# EAGLE design Nusbio.smd (EAGLE 7.5.0)
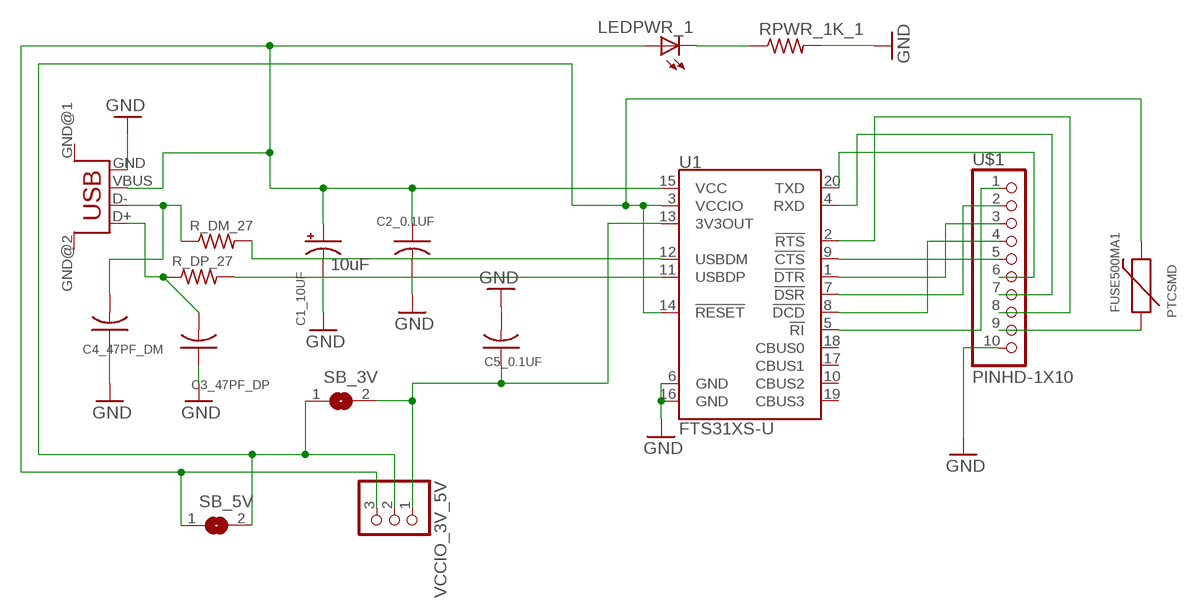
[diagram p0: schematic, sheet 1]

## Parts
C1_10UF  10uF  10UF-16V-10%(TANT)  [EIA3216]
C2_0.1UF  C-USC1206  [C1206]
C3_47PF_DP  C-USC1206  [C1206]
C4_47PF_DM  C-USC1206  [C1206]
C5_0.1UF  C-USC1206  [C1206]
FUSE500MA1  PTCSMD  [PTC-1206]
LEDPWR_1  LEDCHIPLED_0805  [CHIPLED_0805]
R_DM_27  R-US_R0805  [R0805]
R_DP_27  R-US_R0805  [R0805]
RPWR_1K_1  R-US_R0805  [R0805]
SB_3V  SOLDERJUMPERREFLOW  [SOLDERJUMPER_REFLOW]
SB_5V  SOLDERJUMPERREFLOW  [SOLDERJUMPER_REFLOW]
U1  FTS31XS-U  FT231XS  [SSOP20_L]
U$1  PINHD-1X10  [1X10-BIG]
USB_FEMALE  USB  [USB-FEMALE-A-PTH]
VCCIO_3V_5V  PINHD-1X3  [1X03]

## Nets
GND: C1_10UF.C(-) C2_0.1UF.2 C3_47PF_DP.1 C4_47PF_DM.1 C5_0.1UF.2 RPWR_1K_1.2 U1.6(GND) U1.16(GND) U$1.10 USB_FEMALE.GND
N$1: FUSE500MA1.1 U$1.9
N$2: C5_0.1UF.1 SB_3V.2 U1.13(3V3OUT) VCCIO_3V_5V.1
N$3: LEDPWR_1.C RPWR_1K_1.1
N$4: R_DM_27.2 U1.12(USBDM)
N$5: R_DP_27.2 U1.11(USBDP)
N$6: U1.20(TXD) U$1.6
N$7: U1.7(!DSR) U$1.2
N$8: U1.5(!RI) U$1.1
N$9: U1.1(!DTR) U$1.3
N$10: U1.8(!DCD) U$1.4
N$11: U1.9(!CTS) U$1.5
N$12: U1.4(RXD) U$1.7
N$13: U1.2(!RTS) U$1.8
N$14: FUSE500MA1.2 SB_3V.1 SB_5V.2 U1.3(VCCIO) U1.14(!RESET) VCCIO_3V_5V.2
N$15: C3_47PF_DP.2 R_DP_27.1 USB_FEMALE.D+
N$16: C4_47PF_DM.2 R_DM_27.1 USB_FEMALE.D-
N$17: C1_10UF.A(+) C2_0.1UF.1 LEDPWR_1.A SB_5V.1 U1.15(VCC) USB_FEMALE.VBUS VCCIO_3V_5V.3
Unconnected: U1.10(CBUS2) U1.17(CBUS1) U1.18(CBUS0) U1.19(CBUS3) USB_FEMALE.GND@1(GND) USB_FEMALE.GND@2(GND)

## Library data of the parts
C1_10UF = SparkFun-Capacitors:10UF-16V-10%(TANT): CAP-00811 1206/EIA-3216 Tantalum capacitor; PROD_ID: CAP-00811
C2_0.1UF C3_47PF_DP C4_47PF_DM C5_0.1UF = adafruit:C-US: CAPACITOR, American symbol
FUSE500MA1 = SparkFun-PowerIC:PTC: Resettable Fuse PTC Resettable Fuse. Spark Fun Electronics SKU : COM-08357; PROD_ID: RES-11150
LEDPWR_1 = adafruit:LED: LED OSRAM: - CHIPLED LG R971, LG N971, LY N971, LG Q971, LY Q971, LO R971, LY R971 LH N974, LH R974 LS Q976, LO Q976, LY Q976 LO Q996 - Hyper CHIPLED LW Q18S LB Q993, LB Q99A, LB R99A - SideLED LS A670, LO A670, LY A670, LG A670, LP A670 LB A673, LV A673, LT A673, LW A673 LH A674 LY A675 LS A676, LA A676, LO A676, LY A676, LW A676 LS A679, LY A679, LG A679 - Hyper Micro SIDELED® LS Y876, LA Y876, LO Y876, LY Y876 LT Y87S - SmartLED LW L88C, LW L88S LB L89C, LB L89S, LG L890 LS L89K, LO L89K, LY L89K LS L896, LA L896, LO L896, LY L896 - TOPLED LS T670, LO T670, LY T670, LG T670, LP T670 LSG T670, LSP T670, LSY T670, LOP T670, LYG T670 LG T671, LOG T671, LSG T671 LB T673, LV T673, LT T673, LW T673 LH T674 LS T676, LA T676, LO T676, LY T676, LB T676, LH T676, LSB T676, LW T676 LB T67C, LV T67C, LT T67C, LS T67K, LO T67K, LY T67K, LW E67C LS E67B, LA E67B, LO E67B, LY E67B, LB E67C, LV E67C, LT E67C LW T67C LS T679, LY T679, LG T679 LS T770, LO T770, LY T770, LG T770, LP T770 LB T773, LV T773, LT T773, LW T773 LH T774 LS E675, LA E675, LY E675, LS T675 LS T776, LA T776, LO T776, LY T776, LB T776 LHGB T686 LT T68C, LB T68C - Hyper Mini TOPLED® LB M676 - Mini TOPLED Santana® LG M470 LS M47K, LO M47K, LY M47K Source: http://www.osram.convergy.de/
R_DM_27 R_DP_27 RPWR_1K_1 = adafruit:R-US_: RESISTOR, American symbol
SB_3V SB_5V = microbuilder:SOLDERJUMPER: SMD Solder JUMPER Solder the two pads together to create a connection, or remove the solder to break it. REFLOW - Use this footprint for solder paste and reflow ovens. WAVE - Use this footprint for hand-soldering (larger pads). CLOSED - Has a trace between the two pads to ensure it is closed by default. The trace needs to be cut to disable the jumper, and can be closed again by creating a solder bridge between the two pads.
U1 = SparkFun-DigitalIC:FT231X: FTDI FT231X Full Speed USB to Full-handshake UART This USB2.0 Full Speed IC offers a compact bridge to full handshake UART interfaces. The device is a UART, capable of operating up to 3MBaud, with low power consumption (8mA). The FT231X includes the complete FT-X series feature set and enables USB to be added into a system design quickly and easily over a UART interface.; PROD_ID: IC-11524
U$1 = adafruit:PINHD-1X10: Pin header 1x10 0.1" spacing With round pins
USB_FEMALE = STUNTAZ:USB: USB Connectors USB-FEMALE-A-PTH: Through hole Female Type A Connector
VCCIO_3V_5V = adafruit:PINHD-1X3: PIN HEADER

## Board
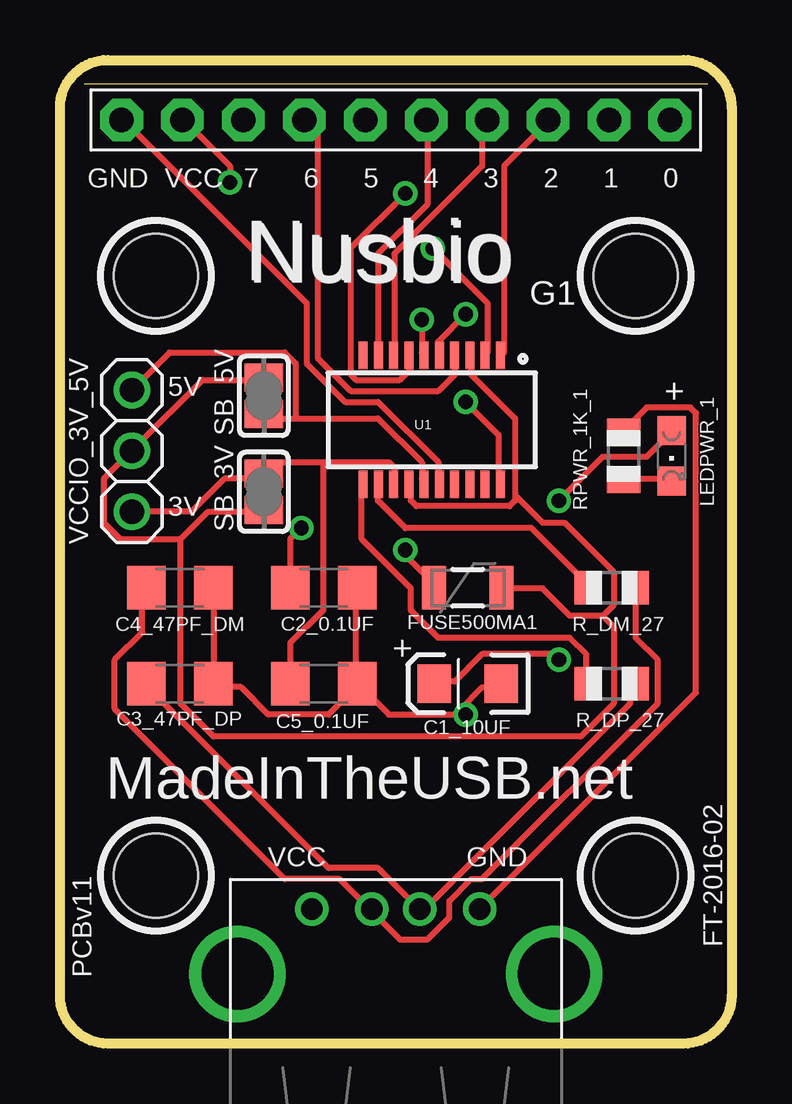
[diagram p1: board, top side]
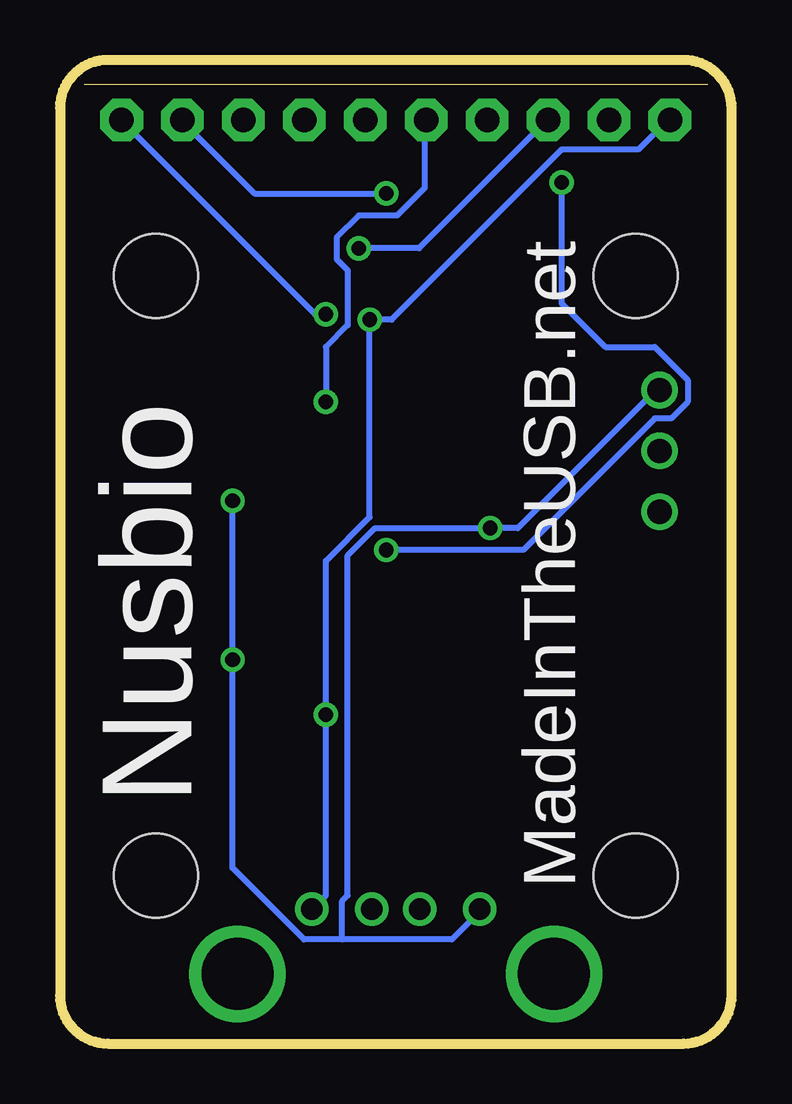
[diagram p2: board, bottom side, seen from below]

Size 28 x 41 mm. Coordinates in mm from the lower left corner, seen from the top.
Outline: 27,40 1,40
Outline: 2,0 arc-90 0,2 0,39 arc-90 2,41 26,41 arc-90 28,39 28,2 arc-90 26,0 2,0
Copper layers (1*16): Top 0.035mm / dielectric 1.5mm / Bottom 0.035mm
Design rules "default": minimum track width 10mil, minimum drill 24mil, track to track 8mil, track to pad 8mil, pad to pad 8mil, via to via 8mil, smd to smd 8mil, copper to edge 40mil, drill to drill 8mil, minimum pad ring 10mil, minimum via ring 8mil, stop-mask expansion 4mil, vias tented up to drill 0mil, thermal gap 10mil
Holes 3.5 mm at 4,7 24,7 24,32 4,32

### Footprints (pad centres in the part's own frame; a part is rotated, then mirrored left to right if it is on the bottom)
EIA3216 = smd 1.4 x 1.6: A 1.4,0; C -1.4,0
C1206 = smd 1.6 x 1.8: 1 -1.4,0; 2 1.4,0
PTC-1206 = smd 1 x 1.8: 1 -1.4,0; 2 1.4,0
CHIPLED_0805 = smd 1.2 x 1.2: A 0,-1.05; C 0,1.05
R0805 = smd 1.1 x 1.4: 1 -1,0; 2 1,0
SOLDERJUMPER_REFLOW = smd 1.168 x 1.6: 1 -0.762,0; 2 0.762,0
SSOP20_L = smd 0.381 x 1.143: 1 -2.857,-2.68; 2 -2.223,-2.68; 3 -1.587,-2.68; 4 -0.953,-2.68; 5 -0.318,-2.68; 6 0.318,-2.68; 7 0.953,-2.68; 8 1.587,-2.68; 9 2.223,-2.68; 10 2.857,-2.68; 11 2.857,2.68; 12 2.223,2.68; 13 1.587,2.68; 14 0.953,2.68; 15 0.318,2.68; 16 -0.318,2.68; 17 -0.953,2.68; 18 -1.587,2.68; 19 -2.223,2.68; 20 -2.857,2.68
1X10-BIG = drill 1.016 pad 1.778 octagon: 1 -11.43,0; 2 -8.89,0; 3 -6.35,0; 4 -3.81,0; 5 -1.27,0; 6 1.27,0; 7 3.81,0; 8 6.35,0; 9 8.89,0; 10 11.43,0
USB-FEMALE-A-PTH = drill 0.9: D+ 5.9,1.3; D- 7.9,1.3; GND 3.4,1.3; VBUS 10.4,1.3 | drill 3: GND@1 13.5,4; GND@2 0.3,4
1X03 = drill 1.016: 1 -2.54,0; 2 0,0; 3 2.54,0

### Placement (x,y rotation side)
C1_10UF  17,15 180 top
C2_0.1UF  11,19 0 top
C3_47PF_DP  5,15 180 top
C4_47PF_DM  5,19 180 top
C5_0.1UF  11,15 0 top
FUSE500MA1  17,19 0 top
LEDPWR_1  25.5,24.5 180 top
R_DM_27  23,19 180 top
R_DP_27  23,15 180 top
RPWR_1K_1  23.5,24.5 90 top
SB_3V  8.5,23 90 top
SB_5V  8.5,27 90 top
U1  15.5,26 180 top
U$1  14,38.5 180 top
USB_FEMALE  20.9,6.9 180 top
VCCIO_3V_5V  3,24.7 90 top

### Tracks (layer width: path | path; a pad name or v marks a point on that pad's centre or on a via)
GND  (via drill 0.61)
  Top 0.254: U1.16 15.77,23.55 15.77,24.23 13.26,26.75 11.89,26.75 10.29,28.35 10.29,30.86 2.74,38.41 U$1.10 | v15.09,30.18 15.09,28.8 U1.6 | C4_47PF_DM.1 6.4,18.97 6.4,15.09 C3_47PF_DP.1 6.4,14.86 7.54,14.86 8.69,13.72 11.2,13.72 12.34,14.86 C5_0.1UF.2 | 16.69,13.95 16.46,13.72 13.72,13.72 12.57,14.86 C5_0.1UF.2 | 16.69,13.95 17.6,14.86 18.29,14.86 C1_10UF.C | C2_0.1UF.2 12.34,18.97 12.34,15.09 C5_0.1UF.2 | RPWR_1K_1.2 23.55,25.6 24.46,26.52 26.29,26.52 26.52,26.29 26.52,14.63 17.6,5.71 USB_FEMALE.GND | v16.92,13.72 16.69,13.95
  Bottom 0.254: U$1.10 2.74,38.41 3.89,37.26 7.09,37.26 14.17,30.18 v15.09,30.18 15.09,21.95 16.92,20.12 v16.92,13.72 16.92,6.17 17.37,5.71 USB_FEMALE.GND
N$1  (via drill 0.61)
  Top 0.254: v14.4,20.57 14.4,20.34 15.54,19.2 FUSE500MA1.1 | v7.09,35.89 7.09,36.58 5.26,38.41 U$1.9
  Bottom 0.254: v14.4,20.57 8.69,20.57 3.2,26.06 2.52,26.06 1.83,26.75 1.83,27.66 3.2,29.03 5.26,29.03 7.09,30.86 v7.09,35.89
N$2
  Top 0.254: 10.97,24.23 9.14,24.23 8.69,23.77 SB_3V.2 8.46,23.55 6.86,23.55 5.49,22.17 3.2,22.17 VCCIO_3V_5V.1 | 10.97,24.23 13.72,24.23 13.95,24 13.95,23.55 U1.13 | 10.97,24.23 10.97,18.06 9.6,16.69 9.6,15.09 C5_0.1UF.1
N$3
  Top 0.254: LEDPWR_1.C 25.38,23.55 23.55,23.55 RPWR_1K_1.1
N$4
  Top 0.254: U1.12 13.26,23.32 13.26,22.63 14.4,21.49 19.66,21.49 21.95,19.2 R_DM_27.2
N$5
  Top 0.254: U1.11 12.57,23.32 12.57,21.03 14.63,18.97 14.63,18.06 15.77,16.92 21.26,16.92 21.95,16.23 21.95,15.09 R_DP_27.2
N$6  (via drill 0.61)
  Top 0.254: v16.92,26.75 18.29,25.38 18.29,23.55 U1.20
  Bottom 0.254: v16.92,26.75 16.92,29.03 16,29.95 16,32.23 16.46,32.69 16.46,33.6 15.54,34.52 13.95,34.52 12.8,35.66 12.8,38.41 U$1.6
N$7  (via drill 0.61)
  Top 0.254: v14.4,35.43 12.12,33.15 12.12,27.89 12.34,27.66 14.17,27.66 14.63,28.12 14.63,28.57 U1.7
  Bottom 0.254: v14.4,35.43 19.89,35.43 22.86,38.41 U$1.2
N$8  (via drill 0.61)
  Top 0.254: v16.92,30.4 15.77,29.26 15.77,28.8 U1.5
  Bottom 0.254: v16.92,30.4 17.37,30.4 25.38,38.41 U$1.1
N$9
  Top 0.254: U1.1 18.52,28.8 18.52,36.58 20.34,38.41 U$1.3
N$10
  Top 0.254: U1.8 13.95,28.8 13.95,32.92 17.6,36.58 17.6,38.41 U$1.4
N$11
  Top 0.254: U1.9 13.26,28.8 13.26,32.92 15.32,34.98 15.32,38.41 U$1.5
N$12
  Top 0.254: U1.4 16.46,28.57 16.46,27.89 15.77,27.2 12.12,27.2 10.74,28.57 10.74,37.95 10.29,38.41 U$1.7
N$13  (via drill 0.61)
  Top 0.254: v15.54,33.15 17.83,30.86 17.83,28.8 U1.2
  Bottom 0.254: v15.54,33.15 13.03,33.15 7.77,38.41 U$1.8
N$14
  Top 0.254: 5.03,21.03 6.17,22.17 8.46,22.17 SB_3V.1 | 5.03,21.03 2.52,21.03 1.83,21.72 1.83,23.55 2.97,24.69 VCCIO_3V_5V.2 3.2,24.92 5.94,27.66 8.46,27.66 SB_5V.2 | 18.97,22.86 18.97,26.06 17.14,27.89 17.14,28.57 U1.3 | 18.97,22.86 18.97,22.63 18.75,22.4 14.86,22.4 14.63,22.63 14.63,23.32 U1.14 | 22.63,17.83 21.26,17.83 20.12,18.97 18.52,18.97 FUSE500MA1.2 | 22.63,17.83 23.09,18.29 23.09,19.66 21.03,21.72 20.12,21.72 18.97,22.86 | 5.03,21.03 5.03,14.17 6.4,12.8 21.72,12.8 23.09,14.17 23.09,17.37 22.63,17.83
N$15
  Top 0.254: R_DP_27.1 23.77,14.86 23.77,14.17 15.09,5.49 USB_FEMALE.D+ 14.86,5.71 13.26,7.32 11.2,7.32 3.66,14.86 C3_47PF_DP.2
N$16
  Top 0.254: R_DM_27.1 24,18.97 24,16.92 24.92,16 24.92,14.17 17.6,6.86 17.14,6.86 16.23,5.94 16.23,5.26 15.32,4.34 14.17,4.34 13.03,5.49 USB_FEMALE.D- 12.8,5.71 11.66,6.86 9.37,6.86 2.29,13.95 2.29,16 3.43,17.14 3.43,18.97 C4_47PF_DM.2
N$17  (via drill 0.61)
  Top 0.254: 9.83,26.06 8.69,26.06 SB_5V.1 | 9.83,26.06 13.26,26.06 15.09,24.23 15.09,23.55 U1.15 | v10.06,21.49 9.6,21.03 9.6,19.2 C2_0.1UF.1 | 9.83,26.06 9.83,28.35 9.37,28.8 4.57,28.8 3.2,27.43 VCCIO_3V_5V.3 | v20.8,22.63 22.63,24.46 24.46,24.46 25.38,25.38 LEDPWR_1.A | v20.8,16 20.57,16.23 17.6,16.23 16.46,15.09 15.77,15.09 C1_10UF.A
  Bottom 0.254: VCCIO_3V_5V.3 3.2,27.2 8.91,21.49 v10.06,21.49 14.86,21.49 16,20.34 16,6.17 16.23,5.94 16.23,4.34 | v20.8,22.63 v20.8,16 20.8,7.32 17.83,4.34 16.23,4.34 | 16.23,4.34 11.66,4.34 10.52,5.49 USB_FEMALE.VBUS

### Text on the board
tNames: GND | VCC | 7 | 6 | 5 | 4 | 3 | 2 | 1 | 0 | Nusbio | Nusbio | G1 | 5V | + | 3V | + | MadeInTheUSB.net | FT-2016-02 | VCC | GND | PCBv11
bNames: Nusbio | MadeInTheUSB.net